# EAGLE schematic main_traced (EAGLE 9.6.2)
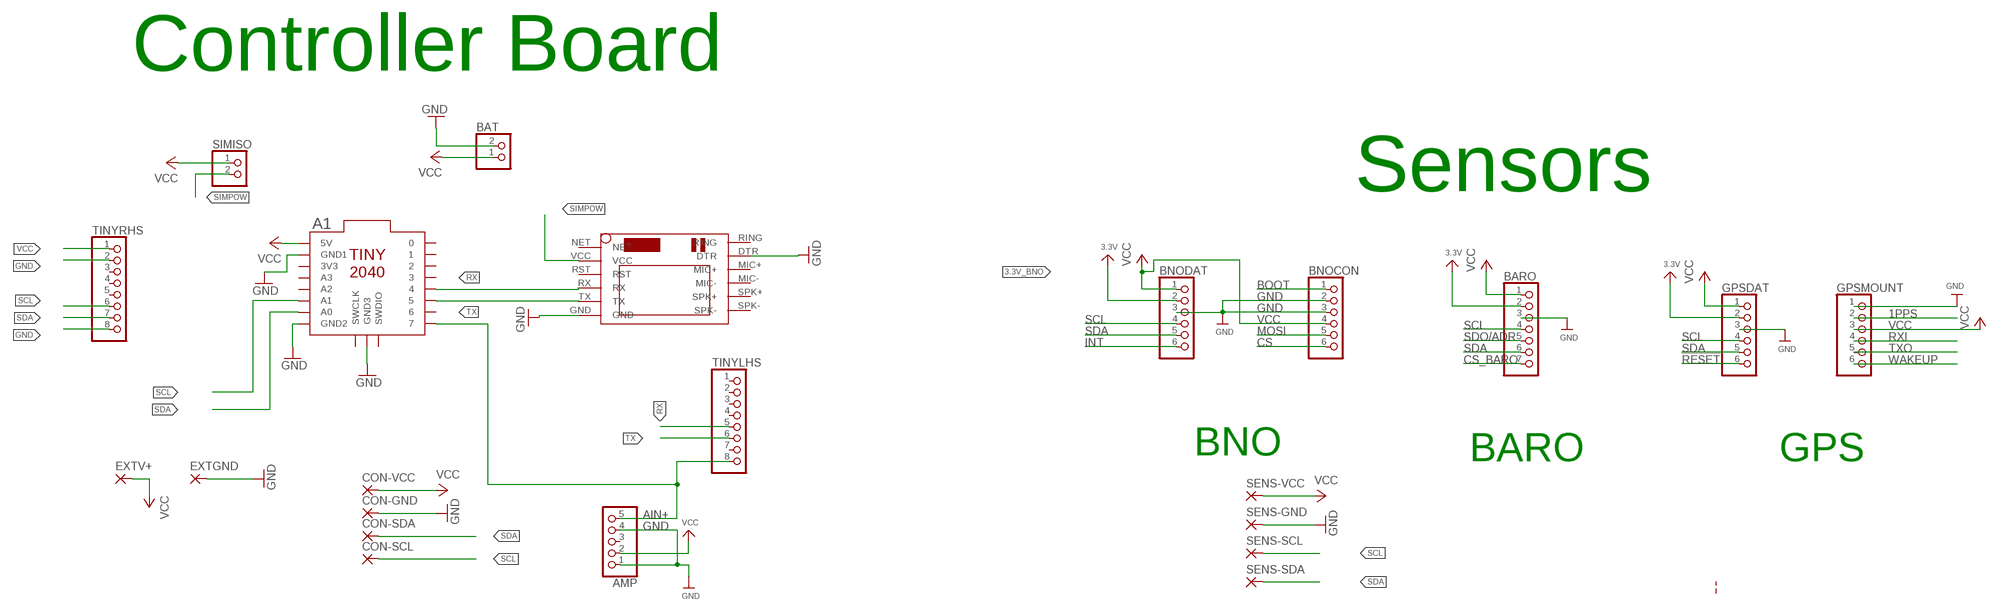
[diagram p0: schematic, sheet 1]

## Parts
A1  TINY2040  [TINY2040]
AMP  HEADER-1X570MIL  [1X05_ROUND_70]
BARO  HEADER-1X770MIL  [1X07_ROUND_70]
BAT  JST_2PIN-THM-RA  [JST-PH-2-THM-RA]
BNOCON  HEADER-1X670MIL  [1X06_ROUND_70]
BNODAT  HEADER-1X670MIL  [1X06_ROUND_70]
CON-GND  3,17/1,3  [3,17/1,3]
CON-SCL  3,17/1,3  [3,17/1,3]
CON-SDA  3,17/1,3  [3,17/1,3]
CON-VCC  3,17/1,3  [3,17/1,3]
EXTGND  SMD5  [SMD2,54-5,08]
EXTV+  SMD5  [SMD2,54-5,08]
GPSDAT  HEADER-1X670MIL  [1X06_ROUND_70]
GPSMOUNT  HEADER-1X670MIL  [1X06_ROUND_70]
SENS-GND  3,17/1,3  [3,17/1,3]
SENS-SCL  3,17/1,3  [3,17/1,3]
SENS-SDA  3,17/1,3  [3,17/1,3]
SENS-VCC  3,17/1,3  [3,17/1,3]
SIMISO  PINHD-1X2  [1X02]
TINYLHS  PINHD-1X8  [1X08]
TINYRHS  PINHD-1X8  [1X08]
U$1  SIM800LMODULE  [SIM800LMODULE]

## Nets
1PPS: GPSMOUNT.2
3.3V_2 [lowpower]: BARO.2 ; supply symbol labelled 3.3V
3.3V_3 [lowpower]: GPSDAT.2 ; supply symbol labelled 3.3V
3.3V_BNO [lowpower]: BNODAT.2 ; supply symbol labelled 3.3V
!RESET: GPSDAT.6
AIN+: A1.7 AMP.5 TINYLHS.8
BOOT: BNOCON.1
CS: BNOCON.6
CS_BARO: BARO.7
GND: A1.GND1 A1.GND2 A1.GND3 AMP.1 AMP.4 BARO.3 BAT.2 BNOCON.2 BNOCON.3 BNODAT.3 CON-GND.1(P) EXTGND.1(P) GPSDAT.3 GPSMOUNT.1 SENS-GND.1(P) TINYRHS.2 TINYRHS.8 U$1.DTR U$1.GND
INT: BNODAT.6
MOSI: BNOCON.5
RX: A1.4 TINYLHS.5 U$1.RX
RXI: GPSMOUNT.4
SCL: A1.A1 BARO.4 BNODAT.4 CON-SCL.1(P) GPSDAT.4 SENS-SCL.1(P) TINYRHS.6
SDA: A1.A0 BARO.6 BNODAT.5 CON-SDA.1(P) GPSDAT.5 SENS-SDA.1(P) TINYRHS.7
SDO/ADR: BARO.5
SIMPOW: SIMISO.2 U$1.VCC
TX: A1.5 TINYLHS.6 U$1.TX
TXO: GPSMOUNT.5
VCC: A1.5V AMP.2 BARO.1 BAT.1 BNOCON.4 BNODAT.1 CON-VCC.1(P) EXTV+.1(P) GPSDAT.1 GPSMOUNT.3 SENS-VCC.1(P) SIMISO.1 TINYRHS.1
WAKEUP: GPSMOUNT.6
Unconnected: A1.0 A1.1 A1.2 A1.3 A1.3V3 A1.6 A1.A2 A1.A3 A1.SWCLK A1.SWDIO AMP.3 TINYLHS.1 TINYLHS.2 TINYLHS.3 TINYLHS.4 TINYLHS.7 TINYRHS.3 TINYRHS.4 TINYRHS.5 U$1.MIC+ U$1.MIC- U$1.NET U$1.RING U$1.RST U$1.SPK+ U$1.SPK-

## Notes on the sheet
- Controller Board
- Sensors
- BNO | BARO | GPS

## Library data of the parts
A1 = pimoroni-boards:TINY2040
AMP = microbuilder:HEADER-1X5: PIN HEADER
BARO = microbuilder:HEADER-1X7: PIN HEADER
BAT = adafruit:JST_2PIN: JST 2-Pin Connectors of various flavors SMT-RA (S2B-PH-SM4) 4UConnector #17311 SMT (B2B-PH-SM4) THM-RA (S2B-PH) THM (B2B-PH)
BNOCON BNODAT GPSDAT GPSMOUNT = microbuilder:HEADER-1X6: PIN HEADER
CON-GND CON-SCL CON-SDA CON-VCC SENS-GND SENS-SCL SENS-SDA SENS-VCC = wirepad:3,17/1,3: THROUGH-HOLE PAD
EXTGND EXTV+ = wirepad:SMD5: SMD PAD
SIMISO = pinhead:PINHD-1X2: PIN HEADER
TINYLHS TINYRHS = pinhead:PINHD-1X8: PIN HEADER
U$1 = SIM800LMODULE:SIM800LMODULE: SIM800L Module

## Net classes
1 highpower: width 0.406 mm, drill 0.483 mm
2 lowpower: width 0.305 mm, drill 0.483 mm